# Altium schematic sheet pqm_v2_page5.SchDoc
size A4; PageSetup: Record=PageOptions|CenterHorizontal=True|CenterVertical=True|PrintScale=1.38|XCorrection=1.00|YCorrection=1.00|PrintKind=1|BorderSize=5000000|LeftOffset=0|BottomOffset=0|Orientation=2|PaperLength=1000|PaperWidth=1000|Scale=100|PaperSource=7|PrintQuality=-4|MediaType=1|DitherType=10|PaperKind=11" x 17"|PrintScaleMode=1
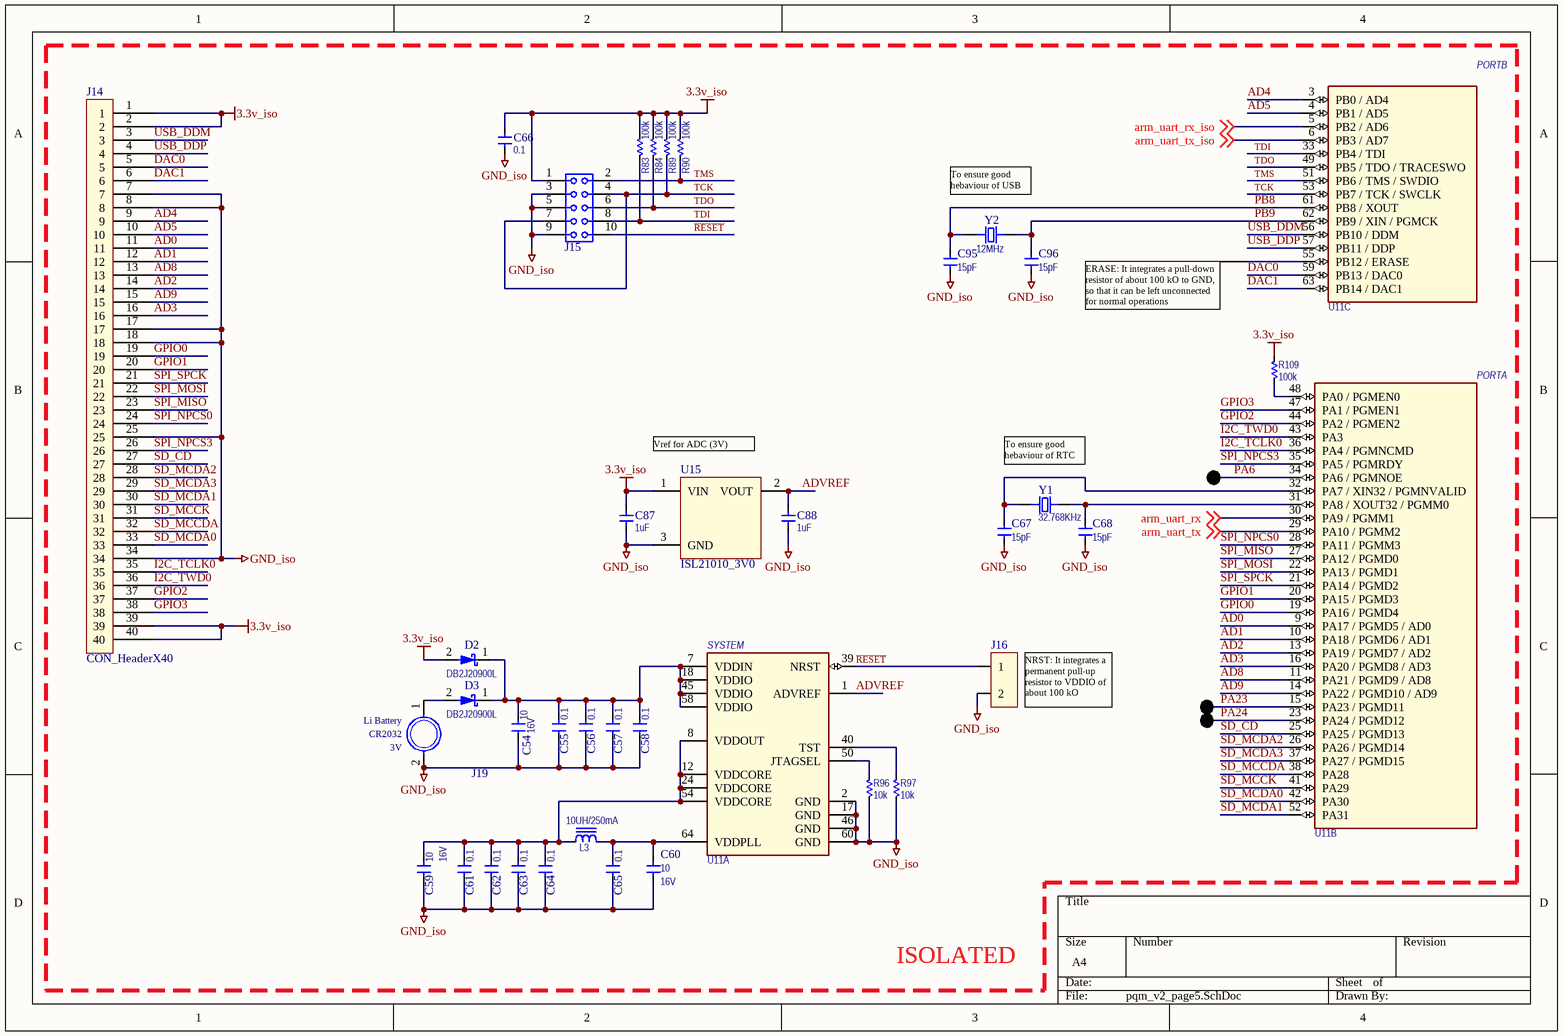
[diagram p0: pqm_v2_page5.SchDoc]

## Parts
C54  value 10  Voltage Rating: 16V  [CAPC2013X110N]  (hidden comment: CAP_C2012X6S1C106K085AC_TDK)
C55  value 0.1  [CAPC2013X110N]  (hidden comment: CAP_CC0805KRX7R8BB104_YAGEO)
C56  value 0.1  [CAPC2013X110N]  (hidden comment: CAP_CC0805KRX7R8BB104_YAGEO)
C57  value 0.1  [CAPC2013X110N]  (hidden comment: CAP_CC0805KRX7R8BB104_YAGEO)
C58  value 0.1  [CAPC2013X110N]  (hidden comment: CAP_CC0805KRX7R8BB104_YAGEO)
C59  value 10  Voltage Rating: 16V  [CAPC2013X110N]  (hidden comment: CAP_C2012X6S1C106K085AC_TDK)
C60  value 10  Voltage Rating: 16V  [CAPC2013X110N]  (hidden comment: CAP_C2012X6S1C106K085AC_TDK)
C61  value 0.1  [CAPC2013X110N]  (hidden comment: CAP_CC0805KRX7R8BB104_YAGEO)
C62  value 0.1  [CAPC2013X110N]  (hidden comment: CAP_CC0805KRX7R8BB104_YAGEO)
C63  value 0.1  [CAPC2013X110N]  (hidden comment: CAP_CC0805KRX7R8BB104_YAGEO)
C64  value 0.1  [CAPC2013X110N]  (hidden comment: CAP_CC0805KRX7R8BB104_YAGEO)
C65  value 0.1  [CAPC2013X110N]  (hidden comment: CAP_CC0805KRX7R8BB104_YAGEO)
C66  value 0.1  [CAPC2013X110N]  (hidden comment: CAP_CC0805KRX7R8BB104_YAGEO)
C67  value 15pF  [CAPC2013X110N]  (hidden comment: CAP_C0805X150J5GACTU_KEMET)
C68  value 15pF  [CAPC2013X110N]  (hidden comment: CAP_C0805X150J5GACTU_KEMET)
C87  value 1uF  [CAPC2013X110N]  (hidden comment: CAP_CC0805KKX7R7BB105_YAGEO)
C88  value 1uF  [CAPC2013X110N]  (hidden comment: CAP_CC0805KKX7R7BB105_YAGEO)
C95  value 15pF  [CAPC2013X110N]  (hidden comment: CAP_C0805X150J5GACTU_KEMET)
C96  value 15pF  [CAPC2013X110N]  (hidden comment: CAP_C0805X150J5GACTU_KEMET)
D2  value DB2J20900L  [SOD2512X097N]  (hidden comment: DIO_DB2J20900L_PANASONIC)
D3  value DB2J20900L  [SOD2512X097N]  (hidden comment: DIO_DB2J20900L_PANASONIC)
J14  CON_HeaderX40  [HeaderX70]
J15  CON_20021121-00010C4LF_FCI  [FCI_20021121-00010C4LF]  (value not drawn)
J16  CON_RADX2  [RAD2]  (value not drawn)
J19  CON_BAT  [CON_BAT_2032]  (value not drawn)
L3  value 10UH/250mA  [INDC4532X170N]  (hidden comment: MAG_CM453232-100KLCT_BOURNS)
R83  value 100k  [RESC2013X065BN]  (hidden comment: RES_AC0805JR-07100KL_YAGEO)
R84  value 100k  [RESC2013X065BN]  (hidden comment: RES_AC0805JR-07100KL_YAGEO)
R89  value 100k  [RESC2013X065BN]  (hidden comment: RES_AC0805JR-07100KL_YAGEO)
R90  value 100k  [RESC2013X065BN]  (hidden comment: RES_AC0805JR-07100KL_YAGEO)
R96  value 10k  [RESC2013X065BN]  (hidden comment: RES_RC0805JR-0710KL_YAGEO)
R97  value 10k  [RESC2013X065BN]  (hidden comment: RES_RC0805JR-0710KL_YAGEO)
R109  value 100k  [RESC2013X065BN]  (hidden comment: RES_AC0805JR-07100KL_YAGEO)
U11  IC_ATSAM4S8BA-AU_ATMEL  [TQFP50P1000X1000X160-64N]  (value not drawn)  (parts A,B,C of 3)
U15  ISL21010_3V0  [SOT23-3M]
Y1  value 32.768KHz  [XTAL3215X090N]  (hidden comment: MSC_ECS-.327-12.5-34S-TR_ECS)
Y2  value 12MHz  [CSM-3X]  (hidden comment: MSC_ECS-120-20-3X-TR_ECS)

## Nets
3.3v_iso: C66.1(T1) C87.1(T1) D2.2(A) J14.1 J14.2 J14.39 J14.40 J15.1 R83.2(T2) R84.2(T2) R89.2(T2) R90.2(T2) R109.2(T2) U15.1(VIN)
GND_iso: C54.2(T2) C55.2(T2) C56.2(T2) C57.2(T2) C58.2(T2) C59.2(T2) C60.2(T2) C61.1(T1) C62.1(T1) C63.1(T1) C64.1(T1) C65.1(T1) C66.2(T2) C67.2(T2) C68.2(T2) C87.2(T2) C88.2(T2) C95.2(T2) C96.2(T2) J14.7 J14.8 J14.17 J14.18 J14.25 J14.34 J15.3 J15.5 J15.9 J16.2 J19.2 R96.1(T1) R97.1(T1) U11.2(GND) U11.17(GND) U11.46(GND) U11.60(GND) U15.3(GND)
AD0: J14.11 U11.9(PA17_/_PGMD5_/_AD0)
AD1: J14.12 U11.10(PA18_/_PGMD6_/_AD1)
AD2: J14.14 U11.13(PA19_/_PGMD7_/_AD2)
AD3: J14.16 U11.16(PA20_/_PGMD8_/_AD3)
AD4: J14.9 U11.3(PB0_/_AD4)
AD5: J14.10 U11.4(PB1_/_AD5)
AD8: J14.13 U11.11(PA21_/_PGMD9_/_AD8)
AD9: J14.15 U11.14(PA22_/_PGMD10_/_AD9)
ADVREF: C88.1(T1) U11.1(ADVREF) U15.2(VOUT)
arm_uart_rx: U11.30(PA9_/_PGMM1) ; off-sheet arm_uart_rx
arm_uart_rx_iso: U11.5(PB2_/_AD6) ; off-sheet arm_uart_rx_iso
arm_uart_tx: U11.29(PA10_/_PGMM2) ; off-sheet arm_uart_tx
arm_uart_tx_iso: U11.6(PB3_/_AD7) ; off-sheet arm_uart_tx_iso
DAC0: J14.5 U11.59(PB13_/_DAC0)
DAC1: J14.6 U11.63(PB14_/_DAC1)
GPIO0: J14.19 U11.19(PA16_/_PGMD4)
GPIO1: J14.20 U11.20(PA15_/_PGMD3)
GPIO2: J14.37 U11.44(PA2_/_PGMEN2)
GPIO3: J14.38 U11.47(PA1_/_PGMEN1)
I2C_TCLK0: J14.35 U11.36(PA4_/_PGMNCMD)
I2C_TWD0: J14.36 U11.43(PA3)
PA6: U11.34(PA6_/_PGMNOE)
PA23: U11.15(PA23_/_PGMD11)
PA24: U11.23(PA24_/_PGMD12)
PB8: C95.1(T1) U11.61(PB8_/_XOUT) Y2.1
PB9: C96.1(T1) U11.62(PB9_/_XIN_/_PGMCK) Y2.2
~{RESET}: J15.10 J16.1 U11.39(NRST)
SD_CD: J14.27 U11.25(PA25_/_PGMD13)
SD_MCCDA: J14.32 U11.38(PA28)
SD_MCCK: J14.31 U11.41(PA29)
SD_MCDA0: J14.33 U11.42(PA30)
SD_MCDA1: J14.30 U11.52(PA31)
SD_MCDA2: J14.28 U11.26(PA26_/_PGMD14)
SD_MCDA3: J14.29 U11.37(PA27_/_PGMD15)
SPI_MISO: J14.23 U11.27(PA12_/_PGMD0)
SPI_MOSI: J14.22 U11.22(PA13_/_PGMD1)
SPI_NPCS0: J14.24 U11.28(PA11_/_PGMM3)
SPI_NPCS3: J14.26 U11.35(PA5_/_PGMRDY)
SPI_SPCK: J14.21 U11.21(PA14_/_PGMD2)
TCK: J15.4 J15.7 R89.1(T1) U11.53(PB7_/_TCK_/_SWCLK)
TDI: J15.8 R83.1(T1) U11.33(PB4_/_TDI)
TDO: J15.6 R84.1(T1) U11.49(PB5_/_TDO_/_TRACESWO)
TMS: J15.2 R90.1(T1) U11.51(PB6_/_TMS_/_SWDIO)
USB_DDM: J14.3 U11.56(PB10_/_DDM)
USB_DDP: J14.4 U11.57(PB11_/_DDP)
NetC54_1: C54.1(T1) C55.1(T1) C56.1(T1) C57.1(T1) C58.1(T1) D2.1(K) D3.1(K) U11.7(VDDIN) U11.18(VDDIO) U11.45(VDDIO) U11.58(VDDIO)
NetC59_1: C59.1(T1) C61.2(T2) C62.2(T2) C63.2(T2) C64.2(T2) L3.1 U11.8(VDDOUT) U11.12(VDDCORE) U11.24(VDDCORE) U11.54(VDDCORE)
NetC60_1: C60.1(T1) C65.2(T2) L3.2 U11.64(VDDPLL)
NetC67_1: C67.1(T1) U11.32(PA7_/_XIN32_/_PGMNVALID) Y1.1
NetC68_1: C68.1(T1) U11.31(PA8_/_XOUT32_/_PGMM0) Y1.2
NetD3_2: D3.2(A) J19.1
NetR96_2: R96.2(T2) U11.50(JTAGSEL)
NetR97_2: R97.2(T2) U11.40(TST)
NetR109_1: R109.1(T1) U11.48(PA0_/_PGMEN0)

Not connected (* = marked no-connect by the designer): U11 55(PB12_/_ERASE)

## Notes on the sheet
- To ensure good hebaviour of USB
- ERASE: It integrates a pull-down resistor of about 100 kO to GND, so that it can be left unconnected for normal operations
- (near U15) Vref for ADC (3V)
- To ensure good hebaviour of RTC
- (near J16) NRST: It integrates a permanent pull-up resistor to VDDIO of about 100 kO
- ISOLATED
- (in symbol CON_BAT) Li Battery; CR2032; 3V
- (in symbol IC_ATSAM4S8BA-AU_ATMEL, part A) SYSTEM
- (in symbol IC_ATSAM4S8BA-AU_ATMEL, part B) PORTA
- (in symbol IC_ATSAM4S8BA-AU_ATMEL, part C) PORTB

## Library data of the parts
C54 C59 C60 = CAP_C2012X6S1C106K085AC_TDK: CAP CER 10UF 16V 10% X6S 0805; Manufacturer: TDK Corporation; Supplier: *; Supplier Part No: 4321; Tolerance: 10%; Power Rating: *; BOM Populate: *; Digikey Part Number: 445-14483-1-ND; Mouser Part Number: 810-C2012X6S1C106K0C; Manufacturer Part Number: C2012X6S1C106K085AC
C55-C58 C61-C66 = CAP_CC0805KRX7R8BB104_YAGEO: CAP CER 0.1UF 25V 10% X7R 0805; Manufacturer: Yageo; Supplier: *; Tolerance: 10%; Power Rating: *; Voltage Rating: 25V; BOM Populate: *; Digikey Part Number: 311-1141-1-ND; Mouser Part Number: 603-CC805KRX7R8BB104; Manufacturer Part Number: CC0805KRX7R8BB104
C67 C68 C95 C96 = CAP_C0805X150J5GACTU_KEMET: CAP CER 15PF 50V NP0 0805; Manufacturer: Kemet; Tolerance: 5%; Digikey Part Number: 399-7428-1-ND; Supplier: *; Power Rating: *; Voltage Rating: 50V; BOM Populate: *; Mouser Part Number: 80-C0805X150J5G; Manufacturer Part Number: C0805X150J5GACTU
C87 C88 = CAP_CC0805KKX7R7BB105_YAGEO: CAP CER 1UF 16V X7R 0805; Manufacturer: YAGEO; Tolerance: 10%; Supplier: *; Supplier Part No: *; Power Rating: *; BOM Populate: *; Voltage Rating: 16V; Digikey Part Number: 311-1365-1-ND; Mouser Part Number: 603-CC805KKX7R7BB105; Manufacturer Part Number: CC0805KKX7R7BB105
D2 D3 = DIO_DB2J20900L_PANASONIC: DIODE SCHOTTKY 20V 500MA SMINI2; Manufacturer: Panasonic; Supplier: *; Supplier Part No: *; Tolerance: *; Power Rating: *; Voltage Rating: 20V; BOM Populate: *; Digikey Part Number: DB2J20900LCT-ND; Manufacturer Part Number: DB2J20900L; Mouser Part Number: 667-DB2J20900L
J15 = CON_20021121-00010C4LF_FCI: CONN HEADER 10POS DL UNSHRD SMD; Manufacturer: FCI; BOM Populate: *; Tolerance: *; Supplier Part No: *; Supplier: *; Voltage Rating: *; Value: 20021121-00010C4LF; Current Rating: *; Digikey Part Number: 609-3695-1-ND; Manufacturer Part Number: 20021121-00010C4LF; Mouser Part Number: 649-202112100010C4LF
J19 = CON_BAT: HOLDER COINCELL 2032 RETAINRCLIP; Digikey Part Number: BS-7-ND; Manufacturer Part Number: *; Mouser Part Number: 122-2420-GR
L3 = MAG_CM453232-100KLCT_BOURNS: FIXED IND 10UH 2A 65 MOHM SMD; Manufacturer: Bourns Inc; BOM Populate: *; Current Rating: *; Supplier: *; Supplier Part No: *; Voltage Rating: *; Tolerance: *; Digikey Part Number: CM453232-100KLCT-ND; Manufacturer Part Number: CM453232-100KL; Mouser Part Number: 652-CM453232-100KL
R83 R84 R89 R90 R109 = RES_AC0805JR-07100KL_YAGEO: RES SMD 100K OHM 5% 1/8W 0805; Manufacturer: Yageo; BOM Populate: *; Supplier Part No: *; Supplier: *; Tolerance: 5%; Digikey Part Number: YAG3756CT-ND; Power Rating: 1/8W; Manufacturer Part Number: AC0805JR-07100KL; Mouser Part Number: 603-AC0805JR-07100KL
R96 R97 = RES_RC0805JR-0710KL_YAGEO: RES SMD 10K OHM 5% 1/8W 0805; Manufacturer: Yageo; BOM Populate: *; Supplier Part No: *; Supplier: *; Tolerance: 5%; Digikey Part Number: 311-10KARCT-ND; Power Rating: 1/8W; Manufacturer Part Number: RC0805JR-0710KL; Mouser Part Number: 603-RC0805JR-0710KL
U11 = IC_ATSAM4S8BA-AU_ATMEL: IC MCU 32BIT 512KB FLASH 64LQFP; Manufacturer: Atmel; BOM Populate: *; Power Rating: *; Supplier: *; Supplier Part No: *; Tolerance: *; Value: ATSAM4S; Voltage Rating: *; Digikey Part Number: ATSAM4S8BA-AU-ND; Manufacturer Part Number: ATSAM4S8BA-AU; Mouser Part Number: 556-ATSAM4S8BA-AU
U15 = IC_ISL21010_3V0_INTERSIL: IC VREF SERIES 3V SOT23-3; Manufacturer Part Number: ISL21010CFH330Z-TK; Digikey Part Number: ISL21010CFH330Z-TKCT-ND; Mouser Part Number: 968-ISL21010CFH330ZT
Y1 = MSC_ECS-.327-12.5-34S-TR_ECS: CRYSTAL 32.7680KHZ 12.5PF SMD; Manufacturer: ECS; BOM Populate: *; Digikey Part Number: XC1967CT-ND; Supplier: *; Supplier Part No: *; Tolerance: *; Power Rating: *; Voltage Rating: *; Manufacturer Part Number: ECS-.327-12.5-34S-TR; Mouser Part Number: 520-ECS32.7-12.534ST
Y2 = MSC_ECS-120-20-3X-TR_ECS: 12 MHz ±30 ppm Cristales 20 pF 60 Ohm -10°C ~ 70°C Montaje en superficie HC49/US; Manufacturer: ECS Inc.; BOM Populate: *; Digikey Part Number: XC1770DKR-ND; Supplier: *; Supplier Part No: *; Tolerance: *; Power Rating: *; Voltage Rating: *; Manufacturer Part Number: ECS-120-20-3X-TR; Mouser Part Number: 520-120-20-3XT